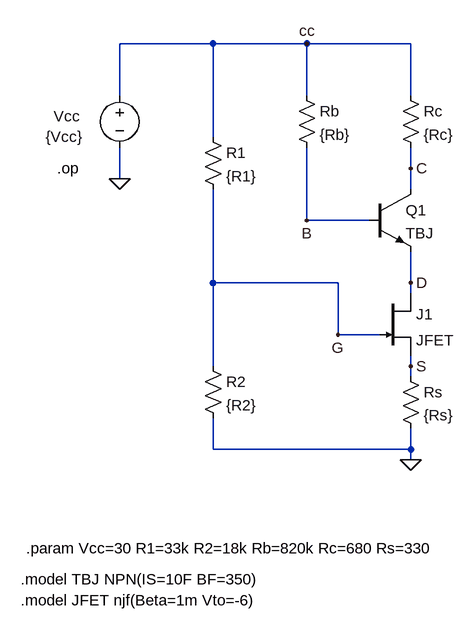
[diagram p0: schematic COMB01op.asc]
COMB01op.asc, the LTspice schematic file:
Version 4
SHEET 1 1608 1076
WIRE 880 -144 736 -144
WIRE 1024 -144 880 -144
WIRE 1184 -144 1024 -144
WIRE 736 -64 736 -144
WIRE 1024 -64 1024 -144
WIRE 1184 -64 1184 -144
WIRE 880 0 880 -144
WIRE 1184 48 1184 16
WIRE 736 64 736 16
WIRE 1184 80 1184 48
WIRE 1024 128 1024 16
WIRE 1120 128 1024 128
WIRE 880 224 880 80
WIRE 1072 224 880 224
WIRE 1184 224 1184 176
WIRE 1184 240 1184 224
WIRE 1072 304 1072 224
WIRE 1136 304 1072 304
WIRE 880 352 880 224
WIRE 1184 352 1184 336
WIRE 1184 368 1184 352
WIRE 880 480 880 432
WIRE 1184 480 1184 448
WIRE 1184 480 880 480
WIRE 1184 496 1184 480
FLAG 1184 496 0
FLAG 736 64 0
FLAG 1024 -144 cc
FLAG 1024 128 B
FLAG 1184 48 C
FLAG 1072 304 G
FLAG 1184 352 S
FLAG 1184 224 D
SYMBOL njf 1136 240 R0
SYMATTR InstName J1
SYMATTR Value JFET
SYMBOL res 1008 -80 R0
SYMATTR InstName Rb
SYMATTR Value {Rb}
SYMBOL res 1168 -80 R0
SYMATTR InstName Rc
SYMATTR Value {Rc}
SYMBOL voltage 736 -80 R0
WINDOW 123 0 0 Left 0
WINDOW 39 0 0 Left 0
WINDOW 0 -101 48 Left 2
WINDOW 3 -114 79 Left 2
SYMATTR InstName Vcc
SYMATTR Value {Vcc}
SYMBOL npn 1120 80 R0
SYMATTR InstName Q1
SYMATTR Value TBJ
SYMBOL res 1168 352 R0
SYMATTR InstName Rs
SYMATTR Value {Rs}
SYMBOL res 864 -16 R0
SYMATTR InstName R1
SYMATTR Value {R1}
SYMBOL res 864 336 R0
SYMATTR InstName R2
SYMATTR Value {R2}
TEXT 640 48 Left 2 !.op
TEXT 584 712 Left 2 !.model JFET njf(Beta=1m Vto=-6)
TEXT 592 632 Left 2 !.param Vcc=30 R1=33k R2=18k Rb=820k Rc=680 Rs=330
TEXT 584 680 Left 2 !.model TBJ NPN(IS=10F BF=350)

The netlist it stands for:
* COMB01op.asc
J1 D G S JFET
Rb cc B {Rb}
Rc cc C {Rc}
Vcc cc 0 {Vcc}
Q1 C B D 0 TBJ
Rs S 0 {Rs}
R1 cc G {R1}
R2 G 0 {R2}
.model NPN NPN
.model PNP PNP
.lib standard.bjt
.model NJF NJF
.model PJF PJF
.lib standard.jft
.op
.model JFET njf(Beta=1m Vto=-6)
.param Vcc=30 R1=33k R2=18k Rb=820k Rc=680 Rs=330
.model TBJ NPN(IS=10F BF=350)
.backanno
.end